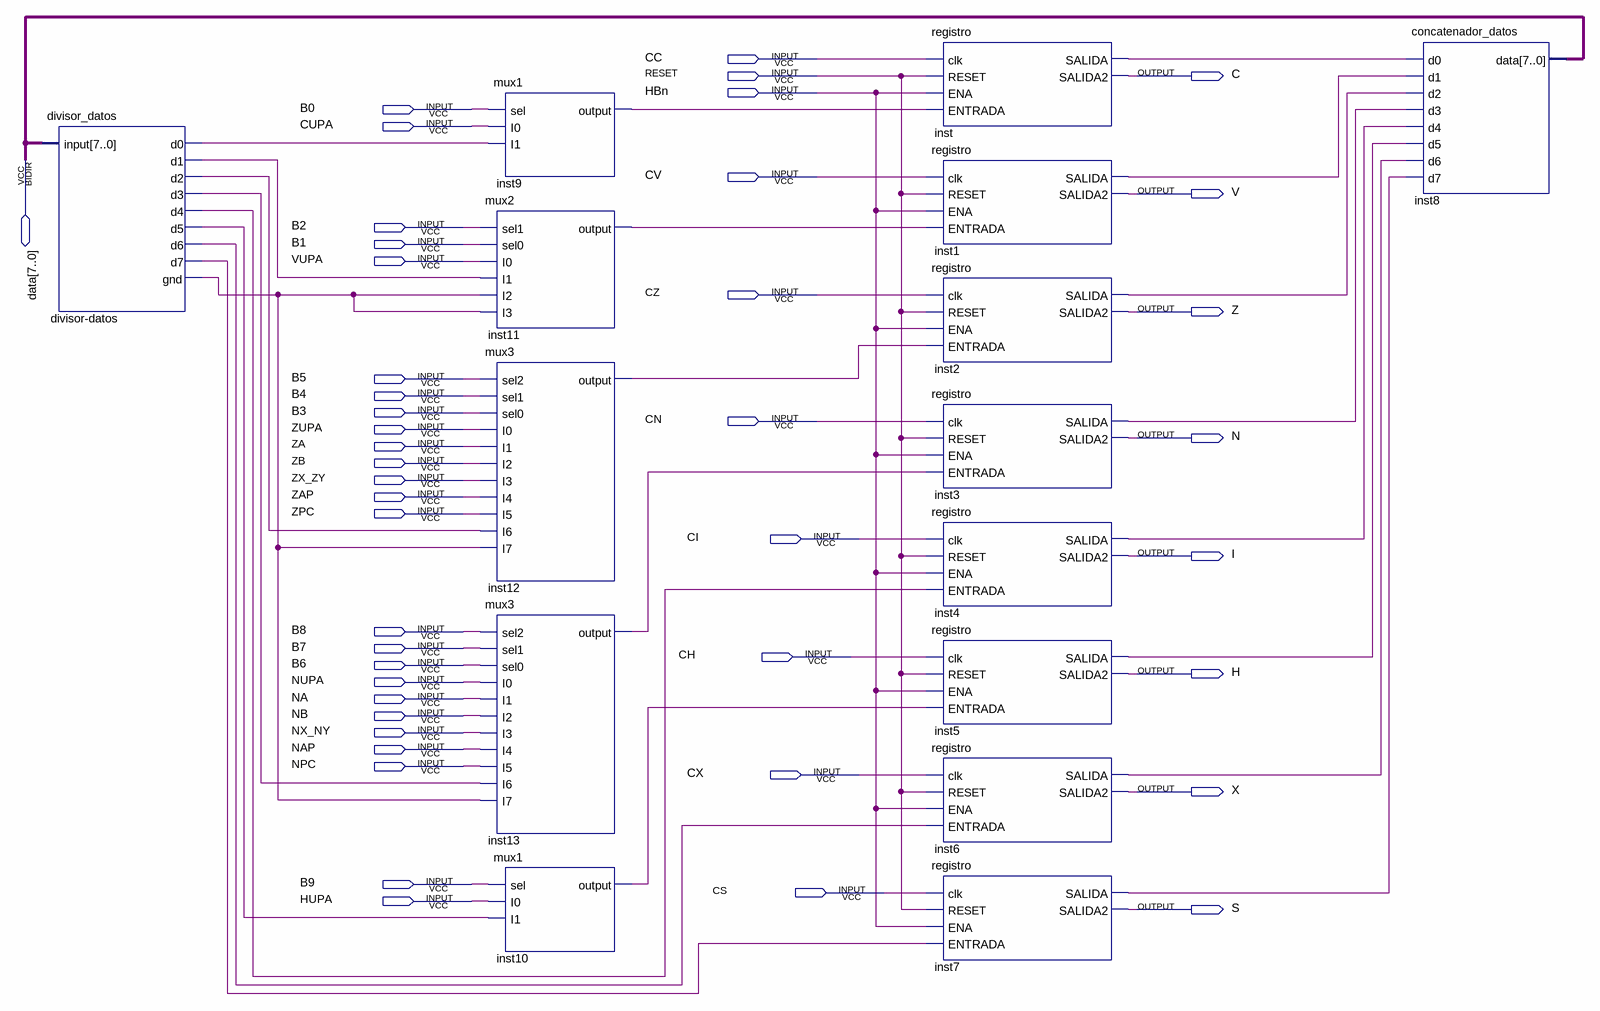
[diagram p0: schematic sheet]
// Quartus schematic red_estados.bdf as structural Verilog: 15 symbols, 44 pins
module red_estados (
  input  CC,
  input  RESET,
  input  HBn,
  input  B0,
  input  CUPA,
  input  CV,
  input  B2,
  input  B1,
  input  VUPA,
  input  CZ,
  input  B5,
  input  B4,
  input  B3,
  input  CN,
  input  ZUPA,
  input  ZA,
  input  ZB,
  input  ZX_ZY,
  input  ZAP,
  input  ZPC,
  input  CI,
  input  B8,
  input  B7,
  input  CH,
  input  B6,
  input  NUPA,
  input  NA,
  input  NB,
  input  NX_NY,
  input  NAP,
  input  NPC,
  input  CX,
  input  B9,
  input  CS,
  input  HUPA,
  inout  [7:0] data,
  output C,
  output V,
  output Z,
  output N,
  output I,
  output H,
  output X,
  output S
);

  wire divisor_datos_d0, divisor_datos_d1, divisor_datos_d2, divisor_datos_d3, divisor_datos_d4,
       divisor_datos_d5, divisor_datos_d6, divisor_datos_d7, divisor_datos_gnd, inst1_salida, inst2_salida,
       inst3_salida, inst4_salida, inst5_salida, inst6_salida, inst7_salida, inst9_output, inst10_output,
       inst11_output, inst12_output, inst13_output, inst_salida;

  divisor_datos \divisor-datos  (
    .\input (data), .d0(divisor_datos_d0), .d1(divisor_datos_d1), .d2(divisor_datos_d2),
    .d3(divisor_datos_d3), .d4(divisor_datos_d4), .d5(divisor_datos_d5), .d6(divisor_datos_d6),
    .d7(divisor_datos_d7), .gnd(divisor_datos_gnd));
  mux1 inst9 (.sel(B0), .I0(CUPA), .I1(divisor_datos_d0), .\output (inst9_output));
  mux2 inst11 (
    .sel1(B2), .sel0(B1), .I0(VUPA), .I1(divisor_datos_d1), .I2(divisor_datos_gnd), .I3(divisor_datos_gnd),
    .\output (inst11_output));
  mux3 inst12 (
    .sel2(B5), .sel1(B4), .sel0(B3), .I0(ZUPA), .I1(ZA), .I2(ZB), .I3(ZX_ZY), .I4(ZAP), .I5(ZPC),
    .I6(divisor_datos_d2), .I7(divisor_datos_gnd), .\output (inst12_output));
  mux3 inst13 (
    .sel2(B8), .sel1(B7), .sel0(B6), .I0(NUPA), .I1(NA), .I2(NB), .I3(NX_NY), .I4(NAP), .I5(NPC),
    .I6(divisor_datos_d3), .I7(divisor_datos_gnd), .\output (inst13_output));
  mux1 inst10 (.sel(B9), .I0(HUPA), .I1(divisor_datos_d5), .\output (inst10_output));
  registro inst (.clk(CC), .RESET(RESET), .ENA(HBn), .ENTRADA(inst9_output), .SALIDA(inst_salida), .SALIDA2(C));
  registro inst1 (.clk(CV), .RESET(RESET), .ENA(HBn), .ENTRADA(inst11_output), .SALIDA(inst1_salida), .SALIDA2(V));
  registro inst2 (.clk(CZ), .RESET(RESET), .ENA(HBn), .ENTRADA(inst12_output), .SALIDA(inst2_salida), .SALIDA2(Z));
  registro inst3 (.clk(CN), .RESET(RESET), .ENA(HBn), .ENTRADA(inst13_output), .SALIDA(inst3_salida), .SALIDA2(N));
  registro inst4 (.clk(CI), .RESET(RESET), .ENA(HBn), .ENTRADA(divisor_datos_d4), .SALIDA(inst4_salida), .SALIDA2(I));
  registro inst5 (.clk(CH), .RESET(RESET), .ENA(HBn), .ENTRADA(inst10_output), .SALIDA(inst5_salida), .SALIDA2(H));
  registro inst6 (.clk(CX), .RESET(RESET), .ENA(HBn), .ENTRADA(divisor_datos_d6), .SALIDA(inst6_salida), .SALIDA2(X));
  registro inst7 (.clk(CS), .RESET(RESET), .ENA(HBn), .ENTRADA(divisor_datos_d7), .SALIDA(inst7_salida), .SALIDA2(S));
  concatenador_datos inst8 (
    .d0(inst_salida), .d1(inst1_salida), .d2(inst2_salida), .d3(inst3_salida), .d4(inst4_salida),
    .d5(inst5_salida), .d6(inst6_salida), .d7(inst7_salida), .data(data));
endmodule
